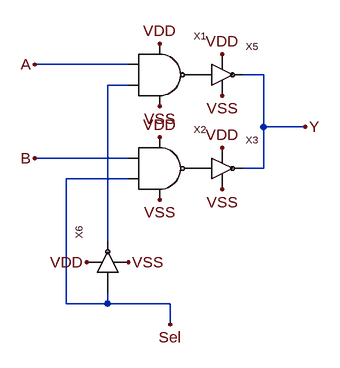
[diagram p0: schematic MUX2-1.asc]
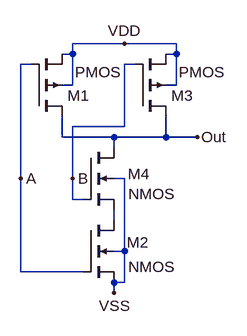
[diagram p1: sub-circuit nand.asc]
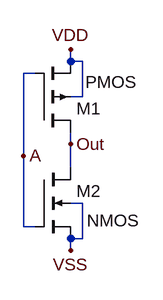
[diagram p2: sub-circuit not.asc]
MUX2-1.asc, the LTspice schematic file:
Version 4
SHEET 1 880 680
WIRE 64 -16 -80 -16
WIRE 272 0 240 0
WIRE 64 16 32 16
WIRE 272 80 272 0
WIRE 336 80 272 80
WIRE 64 128 -80 128
WIRE 272 144 272 80
WIRE 272 144 240 144
WIRE 64 160 -32 160
WIRE 32 256 32 16
WIRE -32 352 -32 160
WIRE 32 352 32 336
WIRE 32 352 -32 352
WIRE 128 352 32 352
WIRE 128 384 128 352
FLAG -80 -16 A
FLAG -80 128 B
FLAG 128 384 Sel
FLAG 336 80 Y
FLAG 112 -48 VDD
FLAG 208 -32 VDD
FLAG 0 288 VDD
FLAG 208 112 VDD
FLAG 112 96 VDD
FLAG 208 176 VSS
FLAG 112 192 VSS
FLAG 64 288 VSS
FLAG 208 32 VSS
FLAG 112 48 VSS
SYMBOL NAND 80 0 R0
SYMATTR InstName X1
SYMBOL NAND 80 144 R0
SYMATTR InstName X2
SYMBOL NOT 192 144 R0
SYMATTR InstName X3
SYMBOL NOT 192 0 R0
SYMATTR InstName X5
SYMBOL NOT 32 304 R270
SYMATTR InstName X6

nand.asc, the sub-circuit schematic file:
Version 4
SHEET 1 880 680
WIRE 352 16 272 16
WIRE 432 16 352 16
WIRE 272 32 272 16
WIRE 272 32 256 32
WIRE 432 32 432 16
WIRE 432 32 416 32
WIRE 208 48 192 48
WIRE 368 48 352 48
WIRE 272 80 272 32
WIRE 272 80 256 80
WIRE 432 80 432 32
WIRE 432 80 416 80
WIRE 352 144 352 48
WIRE 352 144 272 144
WIRE 256 160 256 128
WIRE 336 160 256 160
WIRE 416 160 416 128
WIRE 416 160 336 160
WIRE 464 160 416 160
WIRE 336 176 336 160
WIRE 192 224 192 48
WIRE 272 224 272 144
WIRE 352 224 336 224
WIRE 272 256 272 224
WIRE 288 256 272 256
WIRE 336 288 336 272
WIRE 352 336 352 224
WIRE 352 336 336 336
WIRE 192 368 192 224
WIRE 288 368 192 368
WIRE 352 384 352 336
WIRE 352 384 336 384
WIRE 336 400 336 384
FLAG 336 400 VSS
FLAG 352 16 VDD
FLAG 464 160 Out
FLAG 192 224 A
FLAG 272 224 B
SYMBOL pmos4 208 128 M180
WINDOW 3 68 68 Left 2
SYMATTR InstName M1
SYMATTR Value2 l=500n w=2u
SYMBOL nmos4 288 288 R0
WINDOW 3 70 72 Left 2
WINDOW 0 68 34 Left 2
SYMATTR InstName M2
SYMBOL pmos4 368 128 M180
WINDOW 3 68 68 Left 2
SYMATTR InstName M3
SYMATTR Value2 l=500n w=2u
SYMBOL nmos4 288 176 R0
WINDOW 3 70 72 Left 2
WINDOW 0 69 41 Left 2
SYMATTR InstName M4

not.asc, the sub-circuit schematic file:
Version 4
SHEET 1 880 680
WIRE 256 32 256 16
WIRE 272 32 256 32
WIRE 208 48 192 48
WIRE 272 80 272 32
WIRE 272 80 256 80
WIRE 256 144 256 128
WIRE 192 160 192 48
WIRE 256 176 256 144
WIRE 272 224 256 224
WIRE 192 256 192 160
WIRE 208 256 192 256
WIRE 272 272 272 224
WIRE 272 272 256 272
WIRE 256 288 256 272
FLAG 256 288 VSS
FLAG 256 16 VDD
FLAG 192 160 A
FLAG 256 144 Out
SYMBOL pmos4 208 128 M180
WINDOW 3 68 68 Left 2
SYMATTR InstName M1
SYMATTR Value2 l=500n w=2u
SYMBOL nmos4 208 176 R0
WINDOW 3 70 72 Left 2
SYMATTR InstName M2

The netlist it stands for:
* MUX2-1.asc
XX1 A N001 P001 VSS VDD nand
XX2 B Sel P002 VSS VDD nand
XX3 VDD VSS P002 Y not
XX5 VDD VSS P001 Y not
XX6 VDD VSS Sel N001 not

* block symbol definitions
.subckt nand A B Out VSS VDD
M1 Out A VDD VDD PMOS l=500n w=2u
M2 N001 A VSS VSS NMOS
M3 Out B VDD VDD PMOS l=500n w=2u
M4 Out B N001 VSS NMOS
.ends nand

.subckt not Vdd Vss A Out
M1 Out A VDD VDD PMOS l=500n w=2u
M2 Out A VSS VSS NMOS
.ends not

.model NMOS NMOS
.model PMOS PMOS
.lib standard.mos
.backanno
.end